# Altium schematic sheet PAGE05_88-QFN-DEVICE CO.SchDoc
size 401 x 330 mm
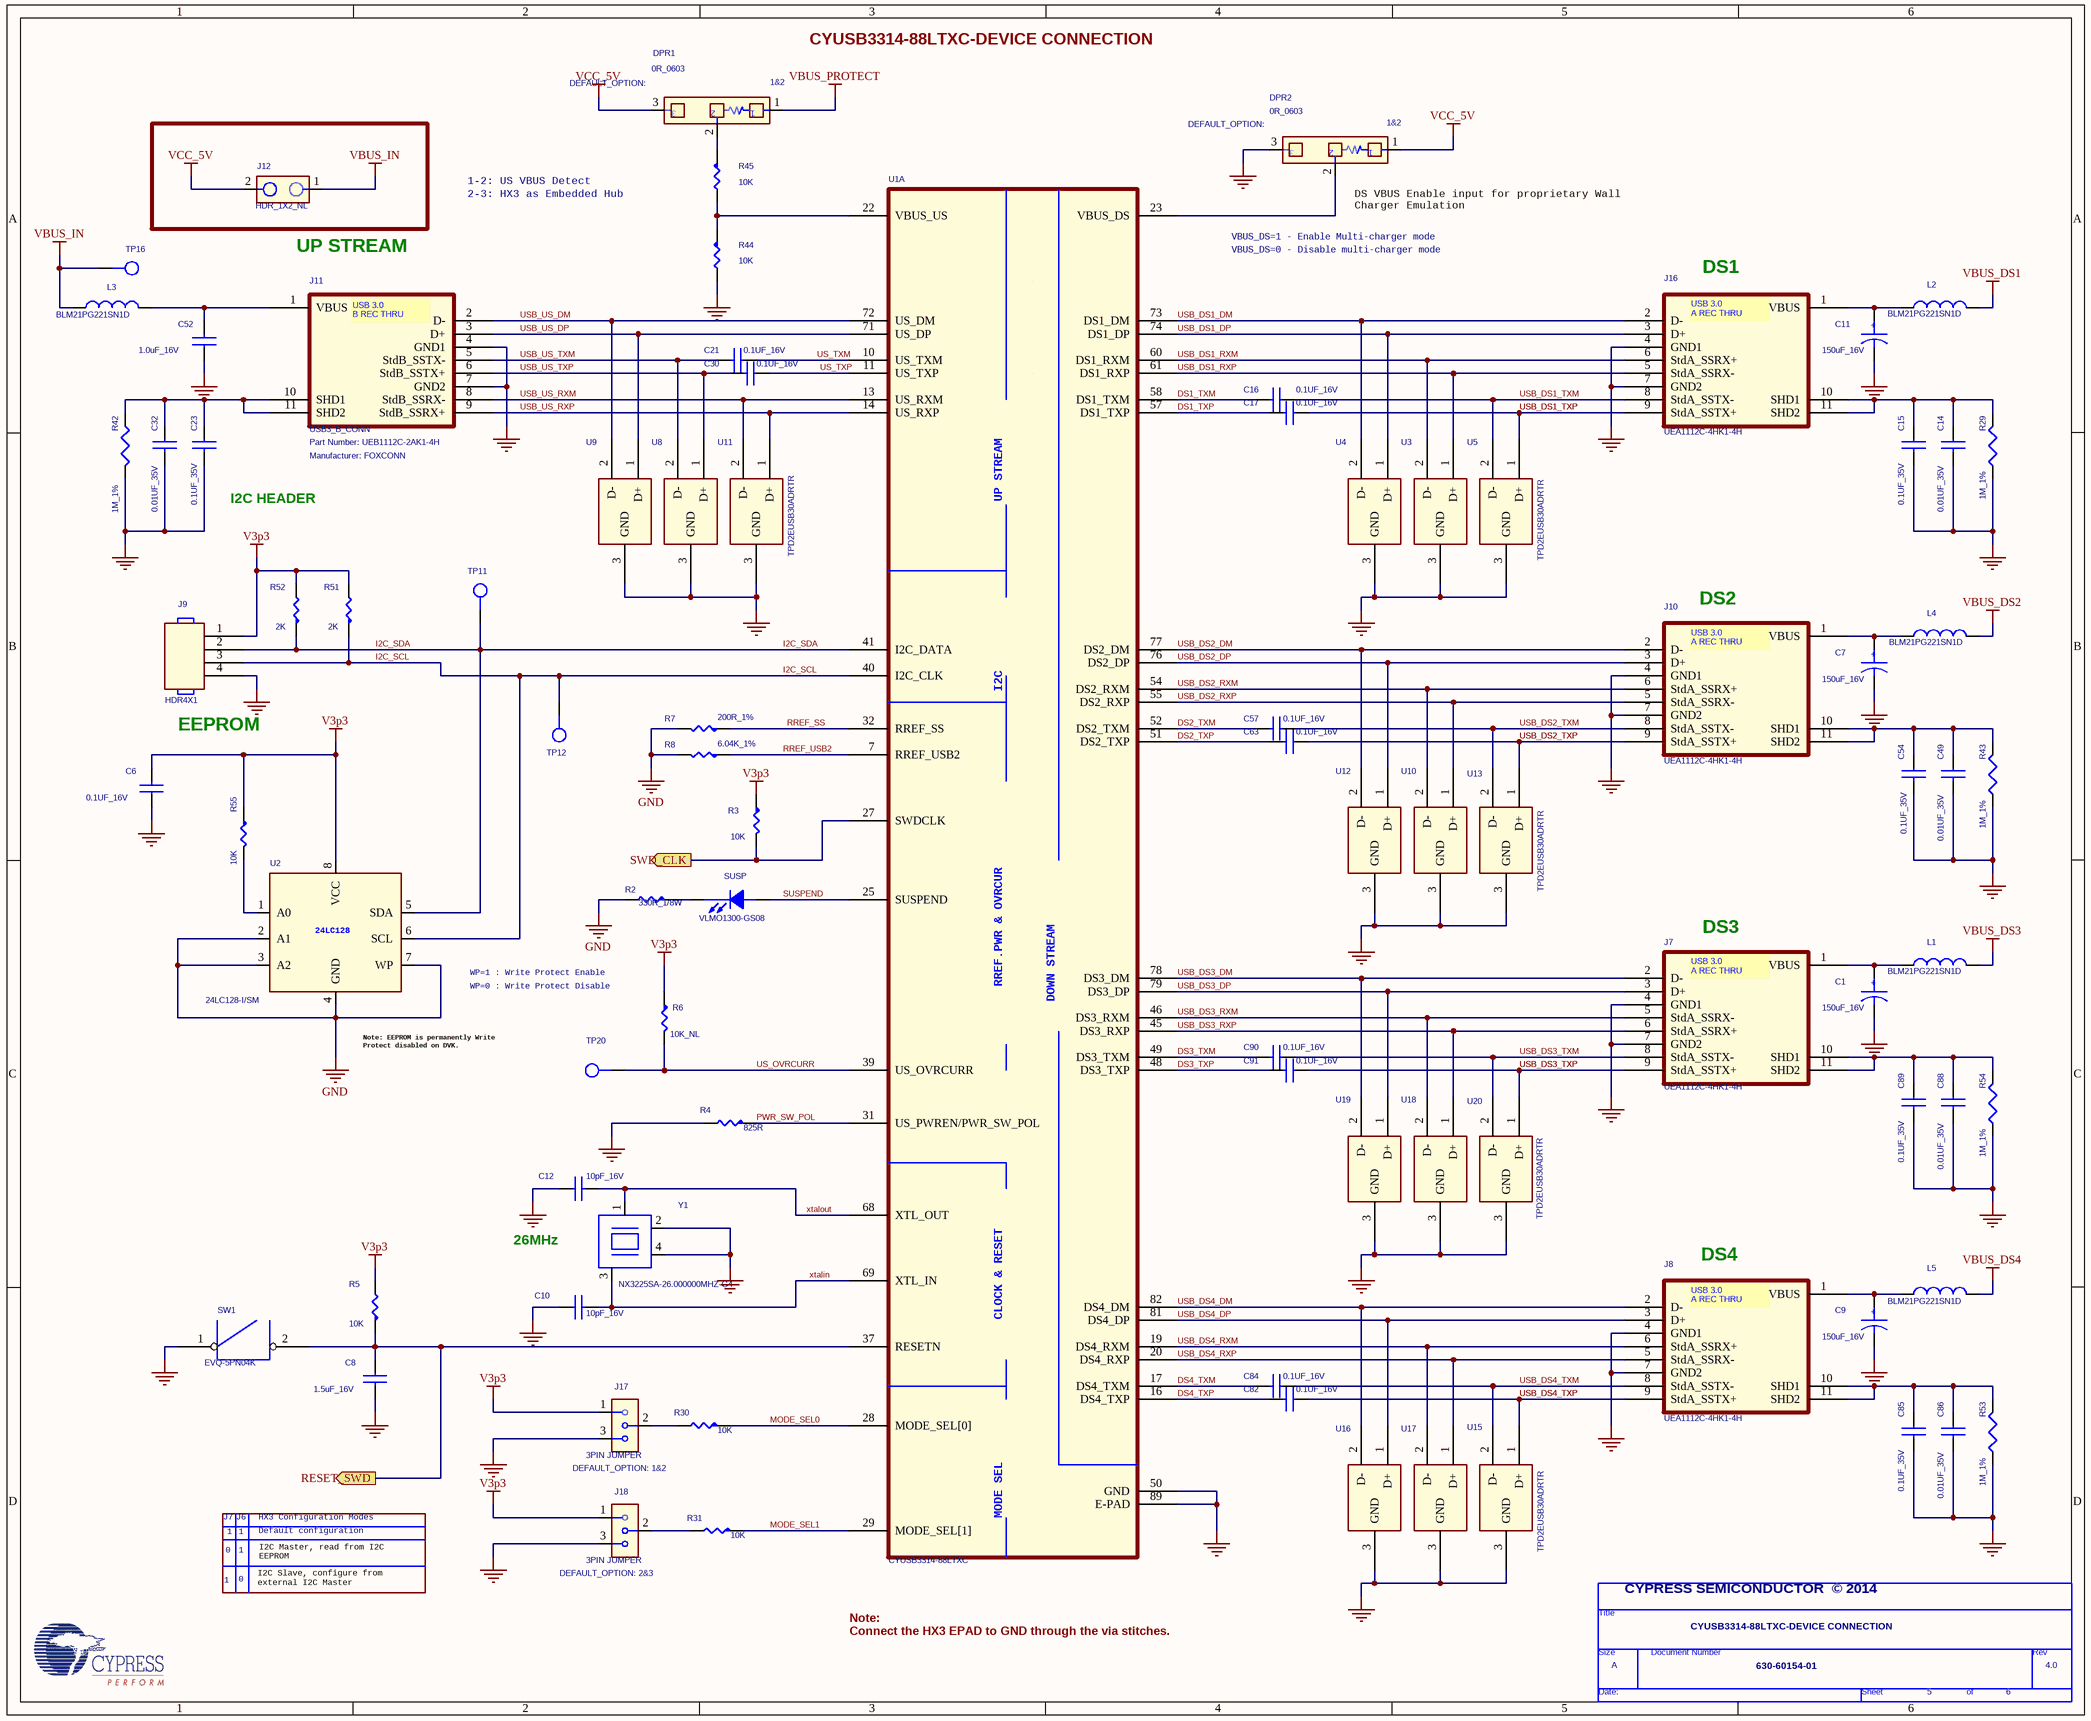
[diagram p0: PAGE05_88-QFN-DEVICE CO.SchDoc]

## Parts
*  Page Count: 6  Page Number: 5  Page Size: A  Title: CYUSB3314-88LTXC-DEVICE CONNECTION  RevCode: 4.0  Doc: 630-60154-01  (hidden comment: TitleBlock0)  (graphical)
C1  150uF_16V  [CAPAE660X800M]
C6  0.1UF_16V  [CAPC1005X56M]
C7  150uF_16V  [CAPAE660X800M]
C8  1.5uF_16V  [CAPC1608X90M]
C9  150uF_16V  [CAPAE660X800M]
C10  10pF_16V  [CAPC1608X90M]
C11  150uF_16V  [CAPAE660X800M]
C12  10pF_16V  [CAPC1608X90M]
C14  0.01UF_35V  [CAPC1005X55M]
C15  0.1UF_35V  [CAPC1005X55M]
C16  0.1UF_16V  [CAPC1005X56M]
C17  0.1UF_16V  [CAPC1005X56M]
C21  0.1UF_16V  [CAPC1005X56M]
C23  0.1UF_35V  [CAPC1005X55M]
C30  0.1UF_16V  [CAPC1005X56M]
C32  0.01UF_35V  [CAPC1005X55M]
C49  0.01UF_35V  [CAPC1005X55M]
C52  1.0uF_16V  [CAPC1005X56M]
C54  0.1UF_35V  [CAPC1005X55M]
C57  0.1UF_16V  [CAPC1005X56M]
C63  0.1UF_16V  [CAPC1005X56M]
C82  0.1UF_16V  [CAPC1005X56M]
C84  0.1UF_16V  [CAPC1005X56M]
C85  0.1UF_35V  [CAPC1005X55M]
C86  0.01UF_35V  [CAPC1005X55M]
C88  0.01UF_35V  [CAPC1005X55M]
C89  0.1UF_35V  [CAPC1005X55M]
C90  0.1UF_16V  [CAPC1005X56M]
C91  0.1UF_16V  [CAPC1005X56M]
DPR1  0R_0603  Mounting Status: 1&2  [RC0603_3P]
DPR2  0R_0603  Mounting Status: 1&2  [RC0603_3P]
J7  UEA1112C-4HK1-4H  [FOXCONN_UEA1112C-4HK1-4H]
J8  UEA1112C-4HK1-4H  [FOXCONN_UEA1112C-4HK1-4H]
J9  HDR4X1  [SAMTEC_TSW-104-08-G-S]
J10  UEA1112C-4HK1-4H  [FOXCONN_UEA1112C-4HK1-4H]
J11  USB3_B_CONN  Manufacturer: FOXCONN  [FOXCONN_UEB1112C-2AK1-4H]
J12  HDR_1X2_NL  [SAMTEC_TSW-102-08-G-S]
J16  UEA1112C-4HK1-4H  [FOXCONN_UEA1112C-4HK1-4H]
J17  3PIN JUMPER  DEFAULT_OPTION: 1&2  [TE_3-644456-3]
J18  3PIN JUMPER  DEFAULT_OPTION: 2&3  [TE_3-644456-3]
L1  BLM21PG221SN1D  [INDC2012X105M]
L2  BLM21PG221SN1D  [INDC2012X105M]
L3  BLM21PG221SN1D  [INDC2012X105M]
L4  BLM21PG221SN1D  [INDC2012X105M]
L5  BLM21PG221SN1D  [INDC2012X105M]
R2  330R_1/8W  [RESC1608X50M]
R3  10K  [RESC1005X40M]
R4  825R  [RESC1005X40M]
R5  10K  [RESC1608X55M]
R6  10K_NL  [RESC1005X40M]
R7  200R_1%  [RESC1608X50M]
R8  6.04K_1%  [RESC1608X55M_A]
R29  1M_1%  [RESC1608X55M]
R30  10K  [RESC1005X40M]
R31  10K  [RESC1005X40M]
R42  1M_1%  [RESC1608X55M]
R43  1M_1%  [RESC1608X55M]
R44  10K  [RESC1005X40M]
R45  10K  [RESC1005X40M]
R51  2K  [RESC1608X55M]
R52  2K  [RESC1608X55M]
R53  1M_1%  [RESC1608X55M]
R54  1M_1%  [RESC1608X55M]
R55  10K  [RESC1608X55M]
SUSP  VLMO1300-GS08  [LEDC1608X80M]
SW1  EVQ-5PN04K  [SW_EVQ-5PN04K]
TP11  TP_YEL  [KEYSTONE_5000]  (value not drawn)
TP12  TP_YEL  [KEYSTONE_5000]  (value not drawn)
TP16  TP_RED  [KEYSTONE_5000]  (value not drawn)
TP20  TP_YEL  [KEYSTONE_5000]  (value not drawn)
U1  CYUSB3314-88LTXC  [QFN40P1000X1000X100-89M]  (part A of 3)
U2  24LC128-I/SM  [SOIC127P790X203-8M]
U3  TPD2EUSB30ADRTR  [SOTFL35P100X50-3M]  (value not drawn)
U4  TPD2EUSB30ADRTR  [SOTFL35P100X50-3M]  (value not drawn)
U5  TPD2EUSB30ADRTR  [SOTFL35P100X50-3M]
U8  TPD2EUSB30ADRTR  [SOTFL35P100X50-3M]  (value not drawn)
U9  TPD2EUSB30ADRTR  [SOTFL35P100X50-3M]  (value not drawn)
U10  TPD2EUSB30ADRTR  [SOTFL35P100X50-3M]  (value not drawn)
U11  TPD2EUSB30ADRTR  [SOTFL35P100X50-3M]
U12  TPD2EUSB30ADRTR  [SOTFL35P100X50-3M]  (value not drawn)
U13  TPD2EUSB30ADRTR  [SOTFL35P100X50-3M]
U15  TPD2EUSB30ADRTR  [SOTFL35P100X50-3M]
U16  TPD2EUSB30ADRTR  [SOTFL35P100X50-3M]  (value not drawn)
U17  TPD2EUSB30ADRTR  [SOTFL35P100X50-3M]  (value not drawn)
U18  TPD2EUSB30ADRTR  [SOTFL35P100X50-3M]  (value not drawn)
U19  TPD2EUSB30ADRTR  [SOTFL35P100X50-3M]  (value not drawn)
U20  TPD2EUSB30ADRTR  [SOTFL35P100X50-3M]
Y1  NX3225SA-26.000000MHZ-G4  [OSCCC250X320X70-4M]

## Ports
RESET_SWD (out), SWD_CLK (out)

## Nets
GND: C1.2 C6.1 C7.2 C8.2 C9.2 C10.1 C11.2 C12.1 C14.2 C15.2 C23.2 C32.2 C49.2 C52.1 C54.2 C85.2 C86.2 C88.2 C89.2 DPR2.3 J7.4(GND1) J7.7(GND2) J8.4(GND1) J8.7(GND2) J9.4 J10.4(GND1) J10.7(GND2) J11.4(GND1) J11.7(GND2) J16.4(GND1) J16.7(GND2) J17.3 J18.3 R2.2 R4.2 R7.2 R8.2 R29.2 R42.2 R43.2 R44.2 R53.2 R54.2 SW1.1 U1.50(GND) U1.89(E-PAD) U2.2(A1) U2.3(A2) U2.4(GND) U2.7(WP) U3.3(GND) U4.3(GND) U5.3(GND) U8.3(GND) U9.3(GND) U10.3(GND) U11.3(GND) U12.3(GND) U13.3(GND) U15.3(GND) U16.3(GND) U17.3(GND) U18.3(GND) U19.3(GND) U20.3(GND) Y1.2 Y1.4
V3p3: C6.2 J9.1 J17.1 J18.1 R3.1 R5.2 R6.1 R51.2 R52.2 R55.1 U2.8(VCC)
VBUS_DS1: L2.1
VBUS_DS2: L4.1
VBUS_DS3: L1.1
VBUS_DS4: L5.1
VBUS_IN: J12.1 L3.1 TP16.1(TP)
VBUS_PROTECT: DPR1.1
VCC_5V: DPR1.3 DPR2.1 J12.2
DS1_TXM: C16.2 U1.58(DS1_TXM)
DS1_TXP: C17.2 U1.57(DS1_TXP)
DS2_TXM: C57.2 U1.52(DS2_TXM)
DS2_TXP: C63.2 U1.51(DS2_TXP)
DS3_TXM: C90.2 U1.49(DS3_TXM)
DS3_TXP: C91.2 U1.48(DS3_TXP)
DS4_TXM: C84.2 U1.17(DS4_TXM)
DS4_TXP: C82.2 U1.16(DS4_TXP)
I2C_SCL: J9.3 R51.1 TP12.1(TP) U1.40(I2C_CLK) U2.6(SCL)
I2C_SDA: J9.2 R52.1 TP11.1(TP) U1.41(I2C_DATA) U2.5(SDA)
MODE_SEL0: R30.1 U1.28(MODE_SEL[0])
MODE_SEL1: R31.1 U1.29(MODE_SEL[1])
PWR_SW_POL: R4.1 U1.31(US_PWREN/PWR_SW_POL)
RESET_SWD: C8.1 R5.1 SW1.2 U1.37(RESETN) ; port RESET_SWD
RREF_SS: R7.1 U1.32(RREF_SS)
RREF_USB2: R8.1 U1.7(RREF_USB2)
SUSPEND: SUSP.1(ANODE) U1.25(SUSPEND)
SWD_CLK: R3.2 U1.27(SWDCLK) ; port SWD_CLK
US_OVRCURR: R6.2 TP20.1(TP) U1.39(US_OVRCURR)
US_TXM: C21.1 U1.10(US_TXM)
US_TXP: C30.1 U1.11(US_TXP)
USB_DS1_DM: J16.2(D-) U1.73(DS1_DM) U4.2(D-)
USB_DS1_DP: J16.3(D+) U1.74(DS1_DP) U4.1(D+)
USB_DS1_RXM: J16.6(StdA_SSRX+) U1.60(DS1_RXM) U3.2(D-)
USB_DS1_RXP: J16.5(StdA_SSRX-) U1.61(DS1_RXP) U3.1(D+)
USB_DS1_TXM: C16.1 J16.8(StdA_SSTX-) U5.2(D-)
USB_DS1_TXP: C17.1 J16.9(StdA_SSTX+) U5.1(D+)
USB_DS2_DM: J10.2(D-) U1.77(DS2_DM) U12.2(D-)
USB_DS2_DP: J10.3(D+) U1.76(DS2_DP) U12.1(D+)
USB_DS2_RXM: J10.6(StdA_SSRX+) U1.54(DS2_RXM) U10.2(D-)
USB_DS2_RXP: J10.5(StdA_SSRX-) U1.55(DS2_RXP) U10.1(D+)
USB_DS2_TXM: C57.1 J10.8(StdA_SSTX-) U13.2(D-)
USB_DS2_TXP: C63.1 J10.9(StdA_SSTX+) U13.1(D+)
USB_DS3_DM: J7.2(D-) U1.78(DS3_DM) U19.2(D-)
USB_DS3_DP: J7.3(D+) U1.79(DS3_DP) U19.1(D+)
USB_DS3_RXM: J7.5(StdA_SSRX-) U1.46(DS3_RXM) U18.2(D-)
USB_DS3_RXP: J7.6(StdA_SSRX+) U1.45(DS3_RXP) U18.1(D+)
USB_DS3_TXM: C90.1 J7.8(StdA_SSTX-) U20.2(D-)
USB_DS3_TXP: C91.1 J7.9(StdA_SSTX+) U20.1(D+)
USB_DS4_DM: J8.2(D-) U1.82(DS4_DM) U16.2(D-)
USB_DS4_DP: J8.3(D+) U1.81(DS4_DP) U16.1(D+)
USB_DS4_RXM: J8.6(StdA_SSRX+) U1.19(DS4_RXM) U17.2(D-)
USB_DS4_RXP: J8.5(StdA_SSRX-) U1.20(DS4_RXP) U17.1(D+)
USB_DS4_TXM: C84.1 J8.8(StdA_SSTX-) U15.2(D-)
USB_DS4_TXP: C82.1 J8.9(StdA_SSTX+) U15.1(D+)
USB_US_DM: J11.2(D-) U1.72(US_DM) U9.2(D-)
USB_US_DP: J11.3(D+) U1.71(US_DP) U9.1(D+)
USB_US_RXM: J11.8(StdB_SSRX-) U1.13(US_RXM) U11.2(D-)
USB_US_RXP: J11.9(StdB_SSRX+) U1.14(US_RXP) U11.1(D+)
USB_US_TXM: C21.2 J11.5(StdB_SSTX-) U8.2(D-)
USB_US_TXP: C30.2 J11.6(StdB_SSTX+) U8.1(D+)
xtalin: C10.2 U1.69(XTL_IN) Y1.3
xtalout: C12.2 U1.68(XTL_OUT) Y1.1
NetC1_1: C1.1 J7.1(VBUS) L1.2
NetC7_1: C7.1 J10.1(VBUS) L4.2
NetC9_1: C9.1 J8.1(VBUS) L5.2
NetC11_1: C11.1 J16.1(VBUS) L2.2
NetC14_1: C14.1 C15.1 J16.10(SHD1) J16.11(SHD2) R29.1
NetC23_1: C23.1 C32.1 J11.10(SHD1) J11.11(SHD2) R42.1
NetC49_1: C49.1 C54.1 J10.10(SHD1) J10.11(SHD2) R43.1
NetC52_2: C52.2 J11.1(VBUS) L3.2
NetC85_1: C85.1 C86.1 J8.10(SHD1) J8.11(SHD2) R53.1
NetC88_1: C88.1 C89.1 J7.10(SHD1) J7.11(SHD2) R54.1
NetDPR1_2: DPR1.2 R45.1
NetDPR2_2: DPR2.2 U1.23(VBUS_DS)
NetJ17_2: J17.2 R30.2
NetJ18_2: J18.2 R31.2
NetR2_1: R2.1 SUSP.2(CATHODE)
NetR44_1: R44.1 R45.2 U1.22(VBUS_US)
NetR55_2: R55.2 U2.1(A0)

## Notes on the sheet
- CYUSB3314-88LTXC-DEVICE CONNECTION
- 1-2: US VBUS Detect
- 2-3: HX3 as Embedded Hub
- (near DPR2) DS VBUS Enable input for proprietary Wall
  Charger Emulation
- UP STREAM
- VBUS_DS=0 - Disable multi-charger mode
- VBUS_DS=1 - Enable Multi-charger mode
- (near J16) DS1
- (near C23) I2C HEADER
- (near J10) DS2
- EEPROM
- (near J7) DS3
- WP=1 : Write Protect Enable
- WP=0 : Write Protect Disable
- Note: EEPROM is permanently Write
  Protect disabled on DVK.
- 26MHz
- (near J8) DS4
- J7
- 1
- J6
- HX3 Configuration Modes
- Default configuration
- 0
- I2C Slave, configure from
  external I2C Master
- I2C Master, read from I2C
  EEPROM
- (near *) CYPRESS SEMICONDUCTOR  © 2014
- Note:
  Connect the HX3 EPAD to GND through the via stitches.
- (in symbol CAP POL) +
- (in symbol CYUSB3314-88LTXC_2, part A) UP STREAM; I2C; RREF.PWR & OVRCUR; DOWN STREAM; CLOCK & RESET; MODE SEL
- (in symbol TitleBlock0) Title; Size; Document Number; Rev; Date:; Sheet; of
- (in symbol UEA1112C-4HK1-4H) USB 3.0 / A REC THRU
- (in symbol UEA1112C_TX) USB 3.0 / A REC THRU
- (in symbol UEB1112C-2AK1-4H) USB 3.0 / B REC THRU

## Library data of the parts
C1 C7 C9 C11 = CAP POL: CAP ALUM 150UF 16V 20% SMD; Part Number: EEE-FK1C151XP; Manufacturer: Panasonic Electronic Components; Lead Free: YES
C6 C10 C12 C16 C17 C21 C30 C52 C57 C63 C82 C84 C90 C91 = CAPACITOR NON-POL
  C52 C57 C63 C82 C84: Manufacturer: *; Part Number: *
  C90: Manufacturer: *
C8 = CAPACITOR NON-POL: CAP CER 1.5UF 10V 10% X7R 0805; Manufacturer: TDK Corporation; Lead Free: YES
C14 C32 C49 C86 C88 = CAPACITOR NON-POL: Part Number: C1005X7R1V103M050BB; Manufacturer: *
C15 C23 C54 C85 C89 = CAPACITOR NON-POL: Part Number: C1005X7R1V104K050BB
  C15 C54 C85 C89: Manufacturer: *
DPR1 DPR2 = DPR12_0: Resistor, 4.7K, 0402, 1/10W, 5%; Part Number: ERJ-2GEJ472X
J7 = UEA1112C-4HK1-4H: 9 Position Right Angle 3.0 USB Connector; Manufacturer: FOXCONN; Part Number: UEA1112C-4HK1-4H
J8 J10 J16 = UEA1112C_TX: 9 Position Right Angle 3.0 USB Connector; Manufacturer: FOXCONN; Part Number: UEA1112C-4HK1-4H; Lead Free: YES
J9 = HEADER 4: CONN HEADER 4POS .100" SNGL GOLD; Manufacturer: Samtec Inc; Part Number: TSW-104-08-G-S; Lead Free: YES
J11 = UEB1112C-2AK1-4H: USB 3.0 B Series Right Angle,T/H 9 Pos; Lead Free: YES; Part Number: UEB1112C-2AK1-4H
J12 = HEADER_1x2: Manufacturer: Samtec Inc; Part Number: TSW-102-08-G-S; Lead Free: YES
J17 J18 = 3PIN JUM: CONN HEADER VERT 3POS .100 TIN; Part Number: 3-644456-3; Manufacturer: Tyco Electronics; Type: Single Row,3Pin Header
L1 L2 L4 L5 = INDUCTOR: FERRITE CHIP 220 OHM 2A 0805; Manufacturer: Murata; DEVICE: L3; Part Number: BLM21PG221SN1D; Lead Free: YES
L3 = INDUCTOR: FERRITE CHIP 220 OHM 2A 0805; Manufacturer: Murata; Lead Free: YES; Part Number: BLM21PG221SN1D
R2 = R_Dup1: Lead Free: YES
R3 = R_Dup1: RES 10.0K OHM 1/10W 1% 0603 SMD; Manufacturer: Panasonic - ECG; Part Number: ERJ-3EKF1002V; Lead Free: YES
R4 R30 R31 = R_Dup1: Manufacturer: Panasonic; Part Number: ERJ-2RKF49.9X
R5 = R_Dup1: Part Number: ERJ-2RKF49.9X; Manufacturer: Panasonic
R6 R55 = R_Dup1: RES 10.0K OHM 1/10W 1% 0603 SMD; Part Number: ERJ-3EKF1002V; Manufacturer: Panasonic - ECG; Lead Free: YES
R7 = R_Dup1: RES 200 OHM 1% 0603 SMD; Manufacturer: Stackpole; Part Number: RNCP0603FTD200R
R8 = R_Dup1: RES 6.04K OHM .25W 1% 0603 SMD; Part Number: CRCW06036K04FKEAHP; Manufacturer: Vishay Dale
R29 = R: RES 1M OHM 1/10W 1% 0603 SMD; Manufaturer: Panasonic; Part Number: ERJ-3EKF1004V
R42 = R: RES 1M OHM 1/10W 1% 0603 SMD; Part Number: ERJ-3EKF1004V; Manufacturer: Panasonic
R43 = R: RES 1M OHM 1/10W 1% 0603 SMD; Manufacturer: Panasonic; PART_NUMBER: ERJ-3EKF1004V
R44 = R_Dup1: Part Number: ERJ-2RKF4990X; Manufacturer: Panasonic
R45 = R_Dup1: Manufacturer: Panasonic; Part Number: ERJ-2GE0R00X
R51 = R_Dup1: RES 2.00K OHM 1/10W 1% 0603 SMD; Part Number: MCR03EZPFX2001; Manufacturer: Rohm Semiconductor; Lead Free: YES
R52 = R_Dup1: RES 2.00K OHM 1/10W 1% 0603 SMD; Manufacturer: Rohm Semiconductor; Part Number: MCR03EZPFX2001; Lead Free: YES
R53 R54 = R: RES 1M OHM 1/10W 1% 0603 SMD; Manufacturer: Panasonic; Part Number: ERJ-3EKF1004V
SUSP = LED: Part Number: VLMO1300-GS08
SW1 = B3U1000P: Part Number: EVQ-5PN04K
TP11 TP20 = TP: TEST POINT PC MINI .040"D RED; PART_NUMBER: 5000; Manufacturer: Keystone
TP12 TP16 = TP: TEST POINT PC MINI .040"D RED; Part Number: 5000; Manufacturer: Keystone
U1 = CYUSB3314-88LTXC_2: Part Number: CYUSB3314-88LTXC
U2 = 24LC128: IC EEPROM 128KBIT 400KHZ 8SOIC; Manufacturer: Microchip Technology; Lead Free: YES; Part Number: 24LC128-I/SM
Y1 = CRYSTAL_1: Manufacturer: NDK; Part Number: NX3225SA-26.000000MHZ-G4
* = TitleBlock0: Page Create Date: March  8, 1995
U3-U5 U8-U13 U15-U20 = TPD2EUSB30ADRTR: Part Number: TPD2EUSB30ADRTR
  U10 U12 U13 U15-U20: Manufacturer: *